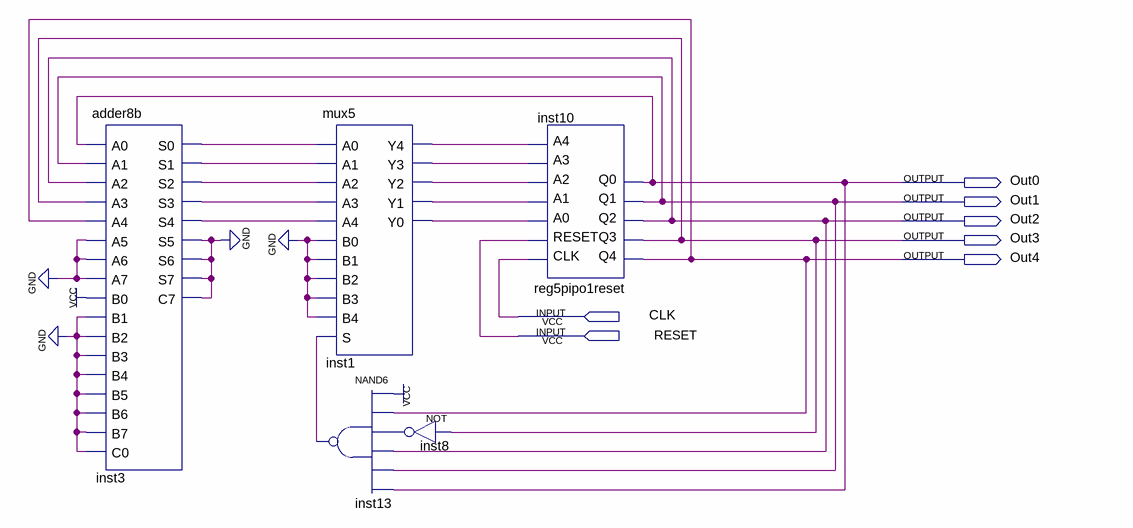
[diagram p0: schematic sheet]
// Quartus schematic cnt5reset23.bdf as structural Verilog: 5 symbols, 7 pins
module cnt5reset23 (
  input  CLK,
  input  RESET,
  output Out0,
  output Out1,
  output Out2,
  output Out3,
  output Out4
);

  wire inst1_y0, inst1_y1, inst1_y2, inst1_y3, inst1_y4, inst3_s0, inst3_s1, inst3_s2, inst3_s3, inst3_s4,
       inst3_s5, inst8_out, inst13_out;

  adder8b inst3 (
    .A0(Out0), .A1(Out1), .A2(Out2), .A3(Out3), .A4(Out4), .A5(1'b0), .A6(1'b0), .A7(1'b0), .B0(1'b1),
    .B1(1'b0), .B2(1'b0), .B3(1'b0), .B4(1'b0), .B5(1'b0), .B6(1'b0), .B7(1'b0), .C0(1'b0), .S0(inst3_s0),
    .S1(inst3_s1), .S2(inst3_s2), .S3(inst3_s3), .S4(inst3_s4), .S5(inst3_s5), .S6(inst3_s5), .S7(inst3_s5),
    .C7(inst3_s5));
  mux5 inst1 (
    .A0(inst3_s0), .A1(inst3_s1), .A2(inst3_s2), .A3(inst3_s3), .A4(inst3_s4), .B0(1'b0), .B1(1'b0),
    .B2(1'b0), .B3(1'b0), .B4(1'b0), .S(inst13_out), .Y0(inst1_y0), .Y1(inst1_y1), .Y2(inst1_y2),
    .Y3(inst1_y3), .Y4(inst1_y4));
  nand inst13 (inst13_out, 1'b1, Out4, inst8_out, Out2, Out1, Out0);
  not inst8 (inst8_out, Out3);
  reg5pipo1reset inst10 (
    .CLK(CLK), .RESET(RESET), .A0(inst1_y0), .A1(inst1_y1), .A2(inst1_y2), .A3(inst1_y3), .A4(inst1_y4),
    .Q4(Out4), .Q3(Out3), .Q2(Out2), .Q1(Out1), .Q0(Out0));
  // also tied to GND on the sheet: inst3_s5
endmodule
